# Altium schematic sheet HV Sense.SchDoc
size 431 x 279 mm; SheetNumber: 4; SheetTotal: 6
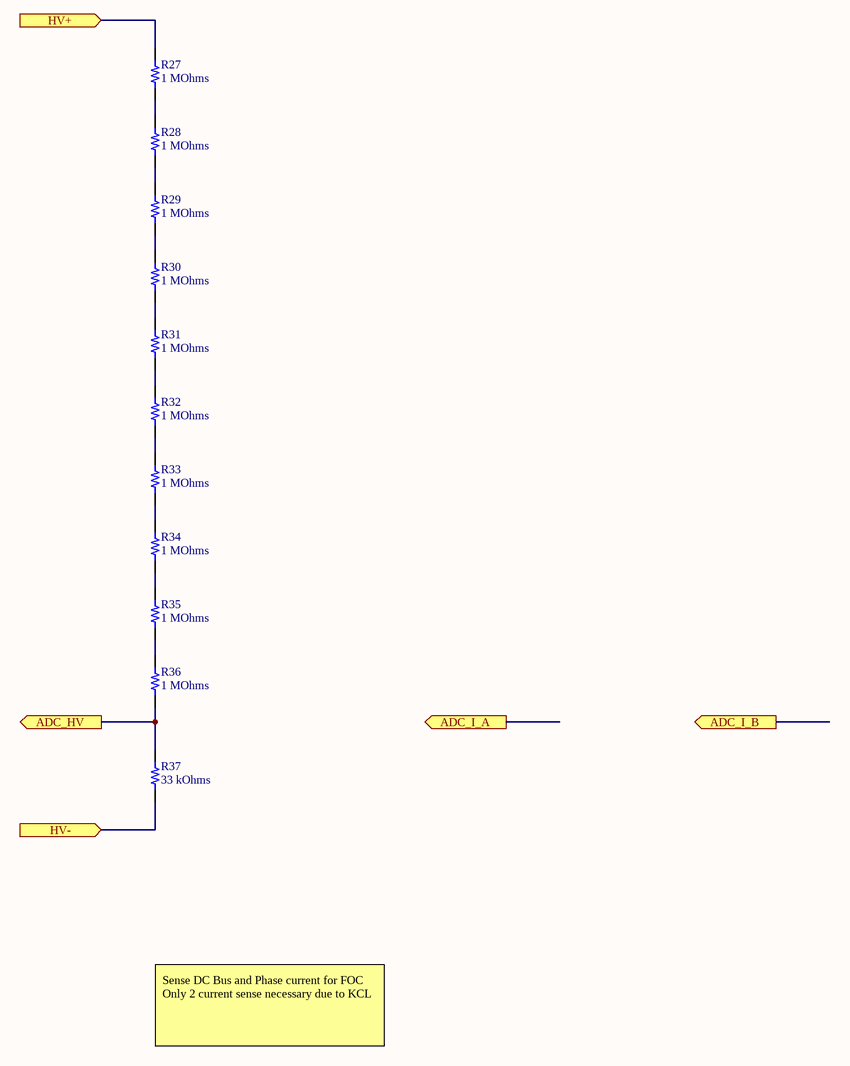
[diagram p0: HV Sense.SchDoc]

## Parts
R27  1 MOhms  [RES 0805_2012]
R28  1 MOhms  [RES 0805_2012]
R29  1 MOhms  [RES 0805_2012]
R30  1 MOhms  [RES 0805_2012]
R31  1 MOhms  [RES 0805_2012]
R32  1 MOhms  [RES 0805_2012]
R33  1 MOhms  [RES 0805_2012]
R34  1 MOhms  [RES 0805_2012]
R35  1 MOhms  [RES 0805_2012]
R36  1 MOhms  [RES 0805_2012]
R37  33 kOhms  [RES 0805_2012]

## Ports
ADC_HV (out), ADC_I_A (out), ADC_I_B (out), HV+ (in), HV- (in)

## Nets
ADC_HV: R36.1 R37.2 ; port ADC_HV
HV+: R27.2 ; port HV+
HV-: R37.1 ; port HV-
NetR27_1: R27.1 R28.2
NetR28_1: R28.1 R29.2
NetR29_1: R29.1 R30.2
NetR30_1: R30.1 R31.2
NetR31_1: R31.1 R32.2
NetR32_1: R32.1 R33.2
NetR33_1: R33.1 R34.2
NetR34_1: R34.1 R35.2
NetR35_1: R35.1 R36.2

## Notes on the sheet
- Sense DC Bus and Phase current for FOC
  Only 2 current sense necessary due to KCL
- Title
- Project
- Scale
- Size
- B
- Part Number
- Engineer
- Sheet
- of
- Rev

## Library data of the parts
R27-R36 = ERA-6AEB105V: RES 1M OHM 0.1% 1/8W 0805; Manufacturer: Panasonic Electronic Components; Power (Watts): 0.125W, 1/8W; Temperature Coefficient: ±25ppm/°C; Part Number: ERA-6AEB105V; Value: 1 MOhms; ComponentLink1Description: Datasheet; ComponentLink1URL: https://industrial.panasonic.com/cdbs/www-data/pdf/RDM0000/AOA0000C307.pdf; ComponentLink2Description: DigiKey Link; ComponentLink2URL: http://digikey.com/product-detail/en/panasonic-electronic-components/ERA-6AEB105V/P1MDACT-ND/1466019; Composition: Thin Film; Device Package: 0805 (2012 Metric); Features: Automotive AEC-Q200; Height - Seated (Max): 0.024" (0.60mm); LastUpdated: 9/2/2020 1:15:23 AM; Lifecycle Status: Active; Minimum Order: 1; Number of Terminations: 2; Operating Temperature: -55°C ~ 155°C; Package / Case: 0805 (2012 Metric); Packaging: TapeAndReel; PartId: 28069; Part Status: Active; Price: 0.04; Ratings: AEC-Q200; Resistance: 1 MOhms; Series: ERA-6A; Size / Dimension: 0.079" L x 0.049" W (2.00mm x 1.25mm); Supplier 1: DigiKey; Supplier Part Number 1: P1MDACT-ND; Supplier Device Package: 0805; Tolerance: ±0.1%
R37 = ERA-6ARB333V: RES 33K OHM 0.1% 1/8W 0805; Manufacturer: Panasonic Electronic Components; Power (Watts): 0.125W, 1/8W; Temperature Coefficient: ±10ppm/°C; Part Number: ERA-6ARB333V; Value: 33 kOhms; ComponentLink1Description: Datasheet; ComponentLink1URL: https://industrial.panasonic.com/cdbs/www-data/pdf/RDM0000/AOA0000C307.pdf; ComponentLink2Description: DigiKey Link; ComponentLink2URL: http://digikey.com/product-detail/en/panasonic-electronic-components/ERA-6ARB333V/P33KBFCT-ND/3073368; Composition: Thin Film; Device Package: 0805 (2012 Metric); Features: Automotive AEC-Q200; Height - Seated (Max): 0.024" (0.60mm); LastUpdated: 9/2/2020 1:15:11 AM; Lifecycle Status: Active; Minimum Order: 1; Number of Terminations: 2; Operating Temperature: -55°C ~ 155°C; Package / Case: 0805 (2012 Metric); Packaging: TapeAndReel; PartId: 33821; Part Status: Active; Price: 0.20; Ratings: AEC-Q200; Resistance: 33 kOhms; Series: ERA-6A; Size / Dimension: 0.079" L x 0.049" W (2.00mm x 1.25mm); Supplier 1: DigiKey; Supplier Part Number 1: P33KBFCT-ND; Supplier Device Package: 0805; Tolerance: ±0.1%